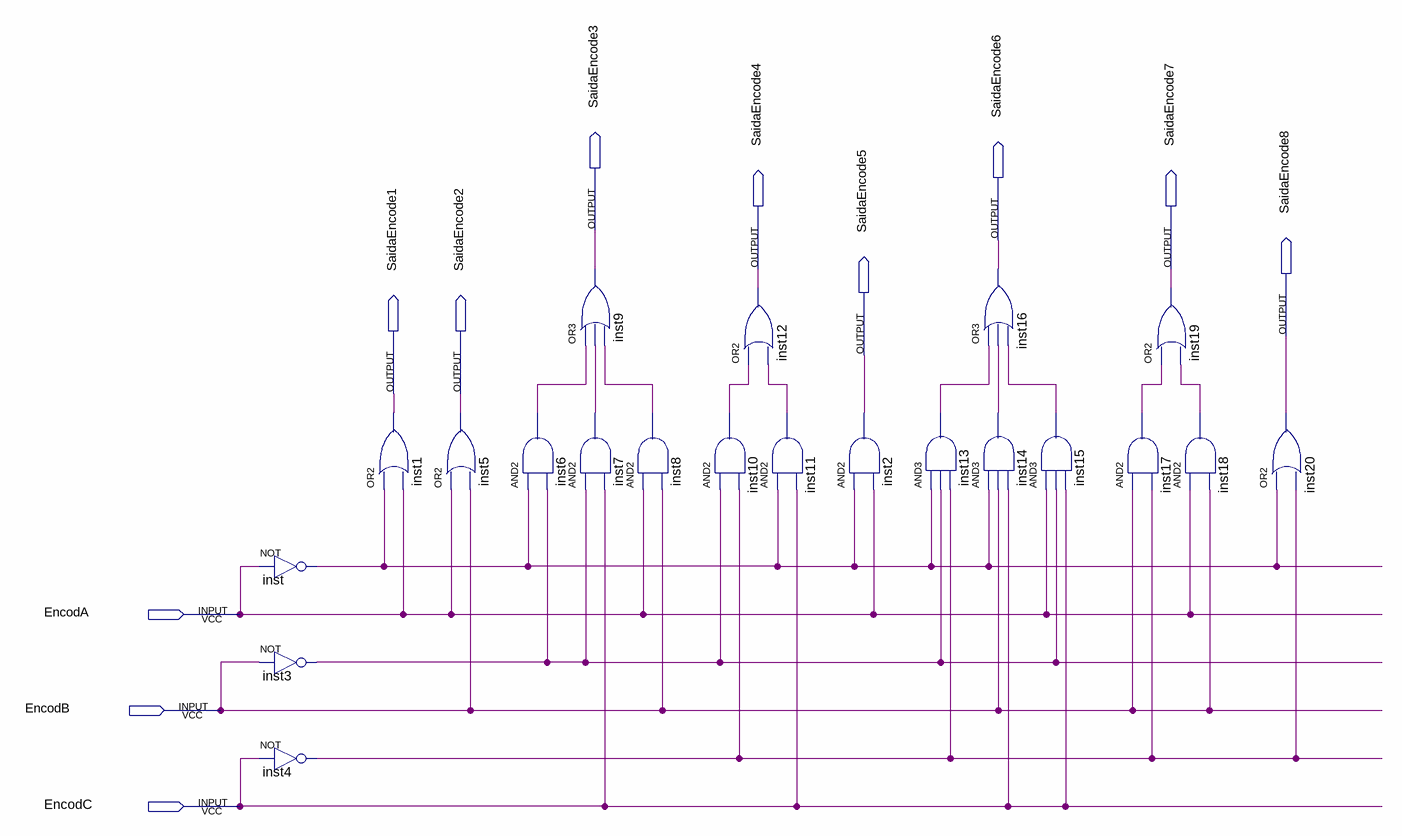
[diagram p0: schematic sheet]
// Quartus schematic Encod.bdf as structural Verilog: 21 symbols, 11 pins
module Encod (
  input  EncodA,
  input  EncodB,
  input  EncodC,
  output SaidaEncode3,
  output SaidaEncode6,
  output SaidaEncode4,
  output SaidaEncode7,
  output SaidaEncode8,
  output SaidaEncode5,
  output SaidaEncode1,
  output SaidaEncode2
);

  wire inst3_out, inst4_out, inst6_out, inst7_out, inst8_out, inst10_out, inst11_out, inst13_out, inst14_out,
       inst15_out, inst17_out, inst18_out, inst_out;

  not inst (inst_out, EncodA);
  not inst3 (inst3_out, EncodB);
  not inst4 (inst4_out, EncodC);
  or inst1 (SaidaEncode1, inst_out, EncodA);
  or inst5 (SaidaEncode2, EncodA, EncodB);
  or inst9 (SaidaEncode3, inst6_out, inst7_out, inst8_out);
  and inst6 (inst6_out, inst_out, inst3_out);
  and inst7 (inst7_out, inst3_out, EncodC);
  and inst8 (inst8_out, EncodA, EncodB);
  and inst10 (inst10_out, inst3_out, inst4_out);
  or inst12 (SaidaEncode4, inst10_out, inst11_out);
  and inst11 (inst11_out, inst_out, EncodC);
  and inst2 (SaidaEncode5, inst_out, EncodA);
  and inst13 (inst13_out, inst_out, inst3_out, inst4_out);
  or inst16 (SaidaEncode6, inst13_out, inst14_out, inst15_out);
  and inst14 (inst14_out, inst_out, EncodB, EncodC);
  and inst15 (inst15_out, EncodA, inst3_out, EncodC);
  or inst19 (SaidaEncode7, inst17_out, inst18_out);
  and inst17 (inst17_out, EncodB, inst4_out);
  and inst18 (inst18_out, EncodA, EncodB);
  or inst20 (SaidaEncode8, inst_out, inst4_out);
endmodule
